# Altium project smars_prj.PrjPcb
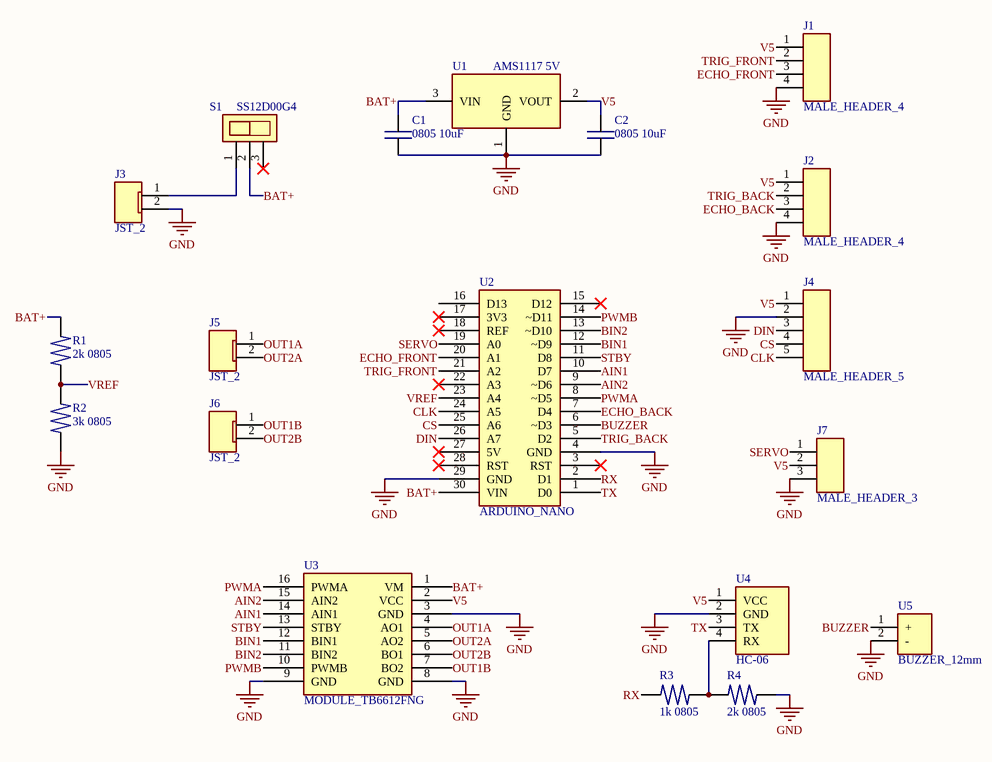
[diagram p0: smars_sch.SchDoc]
1 sheet, 19 parts. Net scope: global (net labels, ports and power ports of the same name join across sheets).
Board file: smars_pcb.PcbDoc

## Sheet smars_sch.SchDoc
size A4; SheetNumber: 1; SheetTotal: 1

### Parts
C1  0805 10uF  [CAPACITOR 0805]
C2  0805 10uF  [CAPACITOR 0805]
J1  MALE_HEADER_4  [MALE_4]
J2  MALE_HEADER_4  [MALE_4]
J3  JST_2  [JST_2]
J4  MALE_HEADER_5  [MALE_5]
J5  JST_2  [JST_2]
J6  JST_2  [JST_2]
J7  MALE_HEADER_3  [MALE_3]
R1  2k 0805  [RESISTOR_0805]
R2  3k 0805  [RESISTOR_0805]
R3  1k 0805  [RESISTOR_0805]
R4  2k 0805  [RESISTOR_0805]
S1  SS12D00G4  [SS12D00G4]
U1  AMS1117 5V  [AMS1117]
U2  ARDUINO_NANO  [ARDUINO_NANO]
U3  MODULE_TB6612FNG  [MODULE_TB6612FNG]
U4  HC-06  [HC-06]
U5  BUZZER_12mm  [BUZZER_12mm]

### Nets
GND: C1.1 C2.1 J1.4 J2.4 J3.2 J4.2 J7.3 R2.2 R4.1 U1.1(GND) U2.4(GND) U2.29(GND) U3.3(GND) U3.8(GND) U3.9(GND) U4.2(GND) U5.2(-)
AIN1: U2.10(D7) U3.14(AIN1)
AIN2: U2.9(~D6) U3.15(AIN2)
BAT+: C1.2 R1.2 S1.2 U1.3(VIN) U2.30(VIN) U3.1(VM)
BIN1: U2.12(~D9) U3.12(BIN1)
BIN2: U2.13(~D10) U3.11(BIN2)
BUZZER: U2.6(~D3) U5.1(+)
CLK: J4.5 U2.24(A5)
CS: J4.4 U2.25(A6)
DIN: J4.3 U2.26(A7)
ECHO_BACK: J2.3 U2.7(D4)
ECHO_FRONT: J1.3 U2.20(A1)
OUT1A: J5.1 U3.4(AO1)
OUT1B: J6.1 U3.7(BO2)
OUT2A: J5.2 U3.5(AO2)
OUT2B: J6.2 U3.6(BO1)
PWMA: U2.8(~D5) U3.16(PWMA)
PWMB: U2.14(~D11) U3.10(PWMB)
RX: R3.1 U2.2(D1)
SERVO: J7.1 U2.19(A0)
STBY: U2.11(D8) U3.13(STBY)
TRIG_BACK: J2.2 U2.5(D2)
TRIG_FRONT: J1.2 U2.21(A2)
TX: U2.1(D0) U4.3(TX)
V5: C2.2 J1.1 J2.1 J4.1 J7.2 U1.2(VOUT) U3.2(VCC) U4.1(VCC)
VREF: R1.1 R2.1 U2.23(A4)
NetJ3_1: J3.1 S1.1
NetR3_2: R3.2 R4.2 U4.4(RX)

Not connected (* = marked no-connect by the designer): S1 3*; U2 3(RST)* 15(D12)* 16(D13) 17(3V3)* 18(REF)* 22(A3)* 27(5V)* 28(RST)*

### Library data of the parts
C1 C2 = CAPACITOR 0805: Generic Capacitor 0805, 2x1.25x1.4mm.
J1 J2 = MALE_HEADER_4: Male Header Connector 2.54mm 4 Pins.
J3 J5 J6 = JST_2: Female Connector JST 2 Vias, 2.54mm.
J4 = MALE_HEADER_5: Male Header Connector 2.54mm 5 Pins.
J7 = MALE_HEADER_3: Male Header Connector 2.54mm 3 Pins.
R1-R4 = RESISTOR_0805: Generic Resistor 0805.
S1 = SS12D00G4: Vertical Slide Switch 3 Pins.
U1 = AMS1117: IC REG LINEAR 1A SOT-89-3L; ComponentLink1Description: Datasheet; ComponentLink1URL: http://www.advanced-monolithic.com/pdf/ds1117.pdf; Digikey PN: 4518-AMS1117-3.3CT-ND; JLCPCB PN: C963410
U2 = ARDUINO_NANO: Based on ATmega328P, Clock 16MHz, Flash 32KB, 14 Digital Pins, 8 Analog Pins, 5V, Vin 7-12V.; ComponentLink1Description: Datasheet; ComponentLink1URL: https://ww1.microchip.com/downloads/en/DeviceDoc/Atmel-7810-Automotive-Microcontrollers-ATmega328P_Datasheet.pdf
U3 = MODULE_TB6612FNG: Module Dual Motor Driver 2.5-13.5V 3.2A Peak 21x18mm; ComponentLink1Description: Datasheet; ComponentLink1URL: https://www.mouser.com/datasheet/2/408/TB6612FNG_datasheet_en_20141001-708260.pdf
U4 = HC-06: BLUETOOTH MODULE, 4 Pins.
U5 = BUZZER_12mm: BUZZER MAGNETIC 12MM; Digikey PN: 433-WT-1209T-ND; Mouser PN: 433-WT-1209T-ND; JLCPCB PN: C781866